# Altium schematic sheet MIXR Processing - SD Card.SchDoc: Micro SD Card & Mux
size B; DocumentNumber: 15; SheetNumber: 15; SheetTotal: 15
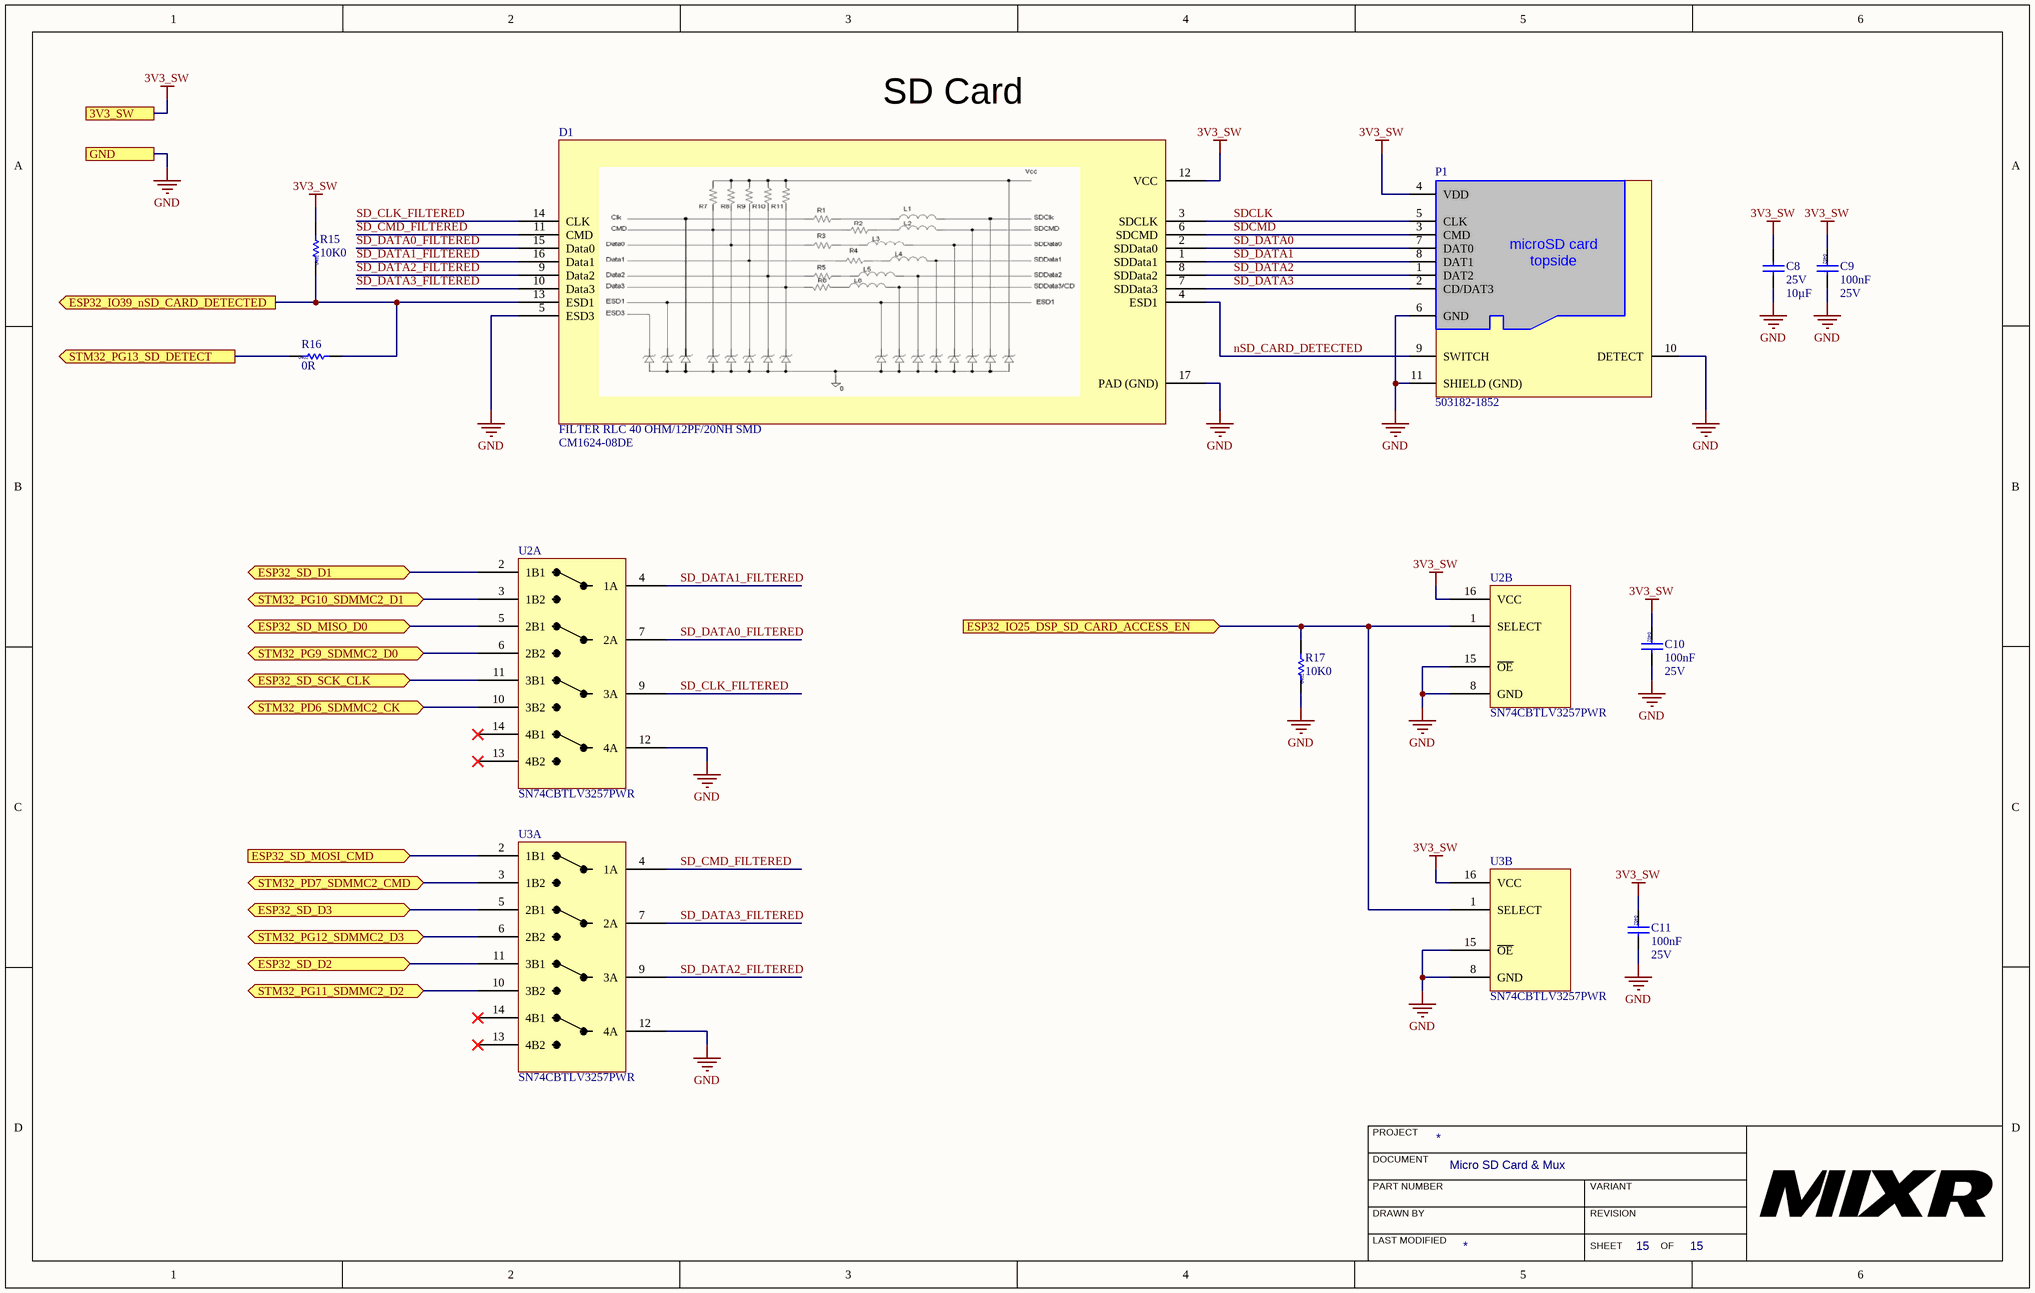
[diagram p0: MIXR Processing - SD Card.SchDoc]

## Parts
C8  Voltage - Rated: 25V  Capacitance: 10µF  [CAP, 0805]  (hidden comment: CAP CER 10uF 25V 10% X5R 0805)
C9  Capacitance: 100nF  Voltage: 25V  [CAP 0402]  (hidden comment: CAP CER 0.1UF 16V X7R 0402)
C10  Capacitance: 100nF  Voltage: 25V  [CAP 0402]  (hidden comment: CAP CER 0.1UF 16V X7R 0402)
C11  Capacitance: 100nF  Voltage: 25V  [CAP 0402]  (hidden comment: CAP CER 0.1UF 16V X7R 0402)
D1  FILTER RLC 40 OHM/12PF/20NH SMD  Manufacturer Part Number 1: CM1624-08DE  [QFN0P135X330X55_HS-17M]
P1  Manufacturer Part Number: 503182-1852  [CONN MICRO-SD HOLDER MOLEX 503182-1852]  (hidden comment: CONN MICRO-SD ULTRA-LOW 8CKT)
R15  Resistance: 10K0  [RES 0402]  (hidden comment: RES 10K OHM 1% 1/16W 0402)
R16  Resistance: 0R  [RES 0402]  (hidden comment: RES 0.0 OHM 1% 1/16W 0402)
R17  Resistance: 10K0  [RES 0402]  (hidden comment: RES 10K OHM 1% 1/16W 0402)
U2  Manufacturer Part Number: SN74CBTLV3257PWR  [TSOP65P640X120-16N]  (hidden comment: IC MUX/DEMUX 4-BIT 1-OF-2 16-TSSOP)  (parts A,B of 2)
U3  Manufacturer Part Number: SN74CBTLV3257PWR  [TSOP65P640X120-16N]  (hidden comment: IC MUX/DEMUX 4-BIT 1-OF-2 16-TSSOP)  (parts A,B of 2)

## Ports
3V3_SW, ESP32_IO25_DSP_SD_CARD_ACCESS_EN (in), ESP32_IO39_nSD_CARD_DETECTED (out), ESP32_SD_D1 (bidir), ESP32_SD_D2 (bidir), ESP32_SD_D3 (bidir), ESP32_SD_MISO_D0 (bidir), ESP32_SD_MOSI_CMD (in), ESP32_SD_SCK_CLK (bidir), GND, STM32_PD6_SDMMC2_CK (bidir), STM32_PD7_SDMMC2_CMD (bidir), STM32_PG9_SDMMC2_D0 (bidir), STM32_PG10_SDMMC2_D1 (bidir), STM32_PG11_SDMMC2_D2 (bidir), STM32_PG12_SDMMC2_D3 (bidir), STM32_PG13_SD_DETECT (out)

## Nets
3V3_SW: C8.1 C9.1 C10.1 C11.1 D1.12(VCC) P1.4(VDD) R15.2 U2.16(VCC) U3.16(VCC) ; port 3V3_SW
GND: C8.2 C9.2 C10.2 C11.2 D1.5(ESD3) D1.17(PAD_(GND)) P1.6(GND) P1.10(DETECT) P1.11(SHIELD_(GND)) R17.1 U2.8(GND) U2.12(4A) U2.15(~{OE}) U3.8(GND) U3.12(4A) U3.15(~{OE}) ; port GND
ESP32_IO25_DSP_SD_CARD_ACCESS_EN: R17.2 U2.1(SELECT) U3.1(SELECT) ; port ESP32_IO25_DSP_SD_CARD_ACCESS_EN
ESP32_IO39_nSD_CARD_DETECTED: D1.13(ESD1) R15.1 R16.2 ; port ESP32_IO39_nSD_CARD_DETECTED
ESP32_SD_D1: U2.2(1B1) ; port ESP32_SD_D1
ESP32_SD_D2: U3.11(3B1) ; port ESP32_SD_D2
ESP32_SD_D3: U3.5(2B1) ; port ESP32_SD_D3
ESP32_SD_MISO_D0: U2.5(2B1) ; port ESP32_SD_MISO_D0
ESP32_SD_MOSI_CMD: U3.2(1B1) ; port ESP32_SD_MOSI_CMD
ESP32_SD_SCK_CLK: U2.11(3B1) ; port ESP32_SD_SCK_CLK
nSD_CARD_DETECTED: D1.4(ESD1) P1.9(SWITCH)
SD_CLK_FILTERED: D1.14(CLK) U2.9(3A)
SD_CMD_FILTERED: D1.11(CMD) U3.4(1A)
SD_DATA0: D1.2(SDData0) P1.7(DAT0)
SD_DATA0_FILTERED: D1.15(Data0) U2.7(2A)
SD_DATA1: D1.1(SDData1) P1.8(DAT1)
SD_DATA1_FILTERED: D1.16(Data1) U2.4(1A)
SD_DATA2: D1.8(SDData2) P1.1(DAT2)
SD_DATA2_FILTERED: D1.9(Data2) U3.9(3A)
SD_DATA3: D1.7(SDData3) P1.2(CD/DAT3)
SD_DATA3_FILTERED: D1.10(Data3) U3.7(2A)
SDCLK: D1.3(SDCLK) P1.5(CLK)
SDCMD: D1.6(SDCMD) P1.3(CMD)
STM32_PD6_SDMMC2_CK: U2.10(3B2) ; port STM32_PD6_SDMMC2_CK
STM32_PD7_SDMMC2_CMD: U3.3(1B2) ; port STM32_PD7_SDMMC2_CMD
STM32_PG9_SDMMC2_D0: U2.6(2B2) ; port STM32_PG9_SDMMC2_D0
STM32_PG10_SDMMC2_D1: U2.3(1B2) ; port STM32_PG10_SDMMC2_D1
STM32_PG11_SDMMC2_D2: U3.10(3B2) ; port STM32_PG11_SDMMC2_D2
STM32_PG12_SDMMC2_D3: U3.6(2B2) ; port STM32_PG12_SDMMC2_D3
STM32_PG13_SD_DETECT: R16.1 ; port STM32_PG13_SD_DETECT

Not connected (* = marked no-connect by the designer): U2 13(4B2)* 14(4B1)*; U3 13(4B2)* 14(4B1)*

## Notes on the sheet
- SD Card
- PROJECT
- DOCUMENT
- DRAWN BY
- LAST MODIFIED
- PART NUMBER
- REVISION
- SHEET
- VARIANT
- OF
- (in symbol CONN MICRO-SD ULTRA-LOW 8CKT) microSD card / topside

## Library data of the parts
C8 = CAP CER 10uF 25V 10% X5R 0805: 10µF ±10% 25V Ceramic Capacitor X5R 0805 (2012 Metric); Manufacturer: Murata Electronics North America; Manufacturer Part Number: GRM21BR61E106KA73L; Supplier 1: Digi-Key; RoHS: RoHS Compliant; Category: Capacitors; Stock 1: 1695157; Packaging: Cut Tape (CT); Part Status: Active; Tolerance: ±10%; Temperature Coefficient: X5R; Operating Temperature: -55°C ~ 85°C; Features: -; Ratings: -; Applications: General Purpose; Mounting Type: Surface Mount, MLCC; Package / Case: 0805 (2012 Metric); Size / Dimension: 0.079" L x 0.049" W (2.00mm x 1.25mm); Height - Seated (Max): -; Thickness (Max): 0.053" (1.35mm); Lead Spacing: -; Lead Style: -; ComponentLink1URL: http://search.murata.co.jp/Ceramy/image/img/A01X/G101/ENG/GRM21BR61E106KA73-01.pdf; ComponentLink1Description: http://search.murata.co.jp/Ceramy/image/img/A01X/G101/ENG/GRM21BR61E106KA73-01.pdf; Supplier Part Number 1: 490-5523-1-ND; Pricing 1: 1=0.3, 10=0.214, 100=0.1008, 500=0.07068, 1000=0.05851 (CAD)
C9-C11 = CAP CER 0.1UF 16V X7R 0402: Cap Ceramic 0.1uF 25V X7R 10% SMD 0402 125C Paper T/R; Manufacturer: Murata; Manufacturer Part Number: GRM155R71E104KE14D; Supplier 1: Digi-Key; Supplier Part Number 1: 490-10698-1-ND; Packaging: Tape and Reel; ComponentLink1URL: http://www.farnell.com/datasheets/2048008.pdf?src-supplier=Farnell; ComponentLink1Description: http://www.farnell.com/datasheets/2048008.pdf?src-supplier=Farnell; Tolerance: 10%; RoHS: Yes; Category: Ceramic Capacitors; Stock 1: 785540; Pricing 1: 1=0.10000, 10=0.03400, 100=0.01520, 500=0.01088, 1000=0.00855, 2500=0.00778, 5000=0.00715 (USD); Mount: Surface Mount; Case/Package: 0402; Weight: 0.000212oz; Case Code (Metric): 1005; Case Code (Imperial): 0402; Dielectric Material: Ceramic; Min Operating Temperature: -55°C; Max Operating Temperature: 125°C; Termination: SMD/SMT; Composition: Ceramic; Package Quantity: 10000; Length: 1mm; Height: 0.5mm; Width: 0.02inch; Thickness: 0.022inch; Depth: 0.5mm; REACH SVHC: Unknown; Lead Free: Lead Free; ComponentLink2URL: http://uk.rs-online.com/webdocs/144c/0900766b8144c113.pdf?src-supplier=RSComponents; ComponentLink2Description: http://uk.rs-online.com/webdocs/144c/0900766b8144c113.pdf?src-supplier=RSComponents; ComponentLink3URL: http://www.farnell.com/datasheets/1872206.pdf?src-supplier=Farnell; ComponentLink3Description: http://www.farnell.com/datasheets/1872206.pdf?src-supplier=Farnell; ComponentLink4URL: http://components.arrow.com/part/dataview/0323_06361249?src-supplier=Arrow+Europe; ComponentLink4Description: http://components.arrow.com/part/dataview/0323_06361249?src-supplier=Arrow+Europe; ComponentLink5URL: http://www.mouser.com/ds/2/281/c02e-2905.pdf?src-supplier=Mouser; ComponentLink5Description: http://www.mouser.com/ds/2/281/c02e-2905.pdf?src-supplier=Mouser; ComponentLink6URL: http://www.farnell.com/datasheets/2048008.pdf?src-supplier=Newark; ComponentLink6Description: http://www.farnell.com/datasheets/2048008.pdf?src-supplier=Newark; ComponentLink7URL: http://psearch.en.murata.com/capacitor/product/GRM155R71E104KE14%23.pdf?src-supplier=Avnet; ComponentLink7Description: http://psearch.en.murata.com/capacitor/product/GRM155R71E104KE14%23.pdf?src-supplier=Avnet; ComponentLink8URL: https://search.murata.co.jp/Ceramy/image/img/A01X/G101/ENG/GRM155R71E104KE14-01.pdf?src-supplier=Digi-Key; ComponentLink8Description: https://search.murata.co.jp/Ceramy/image/img/A01X/G101/ENG/GRM155R71E104KE14-01.pdf?src-supplier=Digi-Key; ComponentLink9URL: http://www.farnell.com/datasheets/2048008.pdf?src-supplier=Element14; ComponentLink9Description: http://www.farnell.com/datasheets/2048008.pdf?src-supplier=Element14; Dielectric: X7R; Voltage Rating (DC): 25V; Voltage Rating: 25V
D1 = FILTER RLC 40 OHM/12PF/20NH SMD: RLC EMI Filter 3rd Order Low Pass 6 Channel R = 40Ohms, C = 12pF, L = 20nH 16-UFDFN Exposed Pad; Manufacturer 1: ON Semiconductor; Operating Supply Voltage: 5V; Capacitance: 20pF; Number of Channels: 6; DC Resistance (DCR): 40R; ESD Protection: Yes; Clamping Voltage: 9V; Direction: Bidirectional; Number of Lines: 8; Supplier 1: Digi-Key; Stock 1: 5050; Pricing 1: 1=0.52000, 10=0.48300, 25=0.46040, 50=0.44560, 100=0.43070, 250=0.40836, 500=0.34156, 1000=0.26507 (USD); RoHS: Yes; Case/Package: DFN; Number of Pins: 16; Contact Plating: Tin,Matte; Min Operating Temperature: -40°C; Max Operating Temperature: 85°C; Package Quantity: 1; Packaging: Tape and Reel; Termination: Flat; Length: 3.4mm; Height: 0.022inch; Width: 1.35mm; Depth: 1.45mm; REACH SVHC: No SVHC; Lead Free: Lead Free; Halogen Free: Halogen Free; ComponentLink1URL: https://datasheet.ciiva.com/1267/cm1624-d-1267908.pdf?src-supplier=Element14; ComponentLink1Description: https://datasheet.ciiva.com/1267/cm1624-d-1267908.pdf?src-supplier=Element14; ComponentLink2URL: https://datasheet.ciiva.com/4942/cm1624-d-92596-4942166.pdf?src-supplier=Mouser; ComponentLink2Description: https://datasheet.ciiva.com/4942/cm1624-d-92596-4942166.pdf?src-supplier=Mouser; ComponentLink3URL: https://datasheet.ciiva.com/26793/cm1624-08de-26793355.pdf?src-supplier=IIIC; ComponentLink3Description: https://datasheet.ciiva.com/26793/cm1624-08de-26793355.pdf?src-supplier=IIIC; ComponentLink4URL: https://datasheet.ciiva.com/1022/cm1624-d-1022810.pdf?src-supplier=Digi-Key; ComponentLink4Description: https://datasheet.ciiva.com/1022/cm1624-d-1022810.pdf?src-supplier=Digi-Key; ComponentLink5URL: https://datasheet.ciiva.com/15225/getdatasheetpartid-650344-15225530.pdf?src-supplier=Verical; ComponentLink5Description: https://datasheet.ciiva.com/15225/getdatasheetpartid-650344-15225530.pdf?src-supplier=Verical; ComponentLink6URL: https://datasheet.ciiva.com/3067/cm1624-d-3067220.pdf?src-supplier=Avnet; ComponentLink6Description: https://datasheet.ciiva.com/3067/cm1624-d-3067220.pdf?src-supplier=Avnet; ComponentLink7URL: https://datasheet.ciiva.com/3067/cm1624-d-3067221.pdf?src-supplier=Avnet; ComponentLink7Description: https://datasheet.ciiva.com/3067/cm1624-d-3067221.pdf?src-supplier=Avnet; ComponentLink8URL: https://datasheet.ciiva.com/1022/cm1624-d-1022808.pdf?src-supplier=Digi-Key; ComponentLink8Description: https://datasheet.ciiva.com/1022/cm1624-d-1022808.pdf?src-supplier=Digi-Key; ComponentLink9URL: https://datasheet.ciiva.com/1022/cm1624-d-1022809.pdf?src-supplier=Digi-Key; ComponentLink9Description: https://datasheet.ciiva.com/1022/cm1624-d-1022809.pdf?src-supplier=Digi-Key; Supplier Part Number 1: CM1624-08DEOSCT-ND
P1 = CONN MICRO-SD ULTRA-LOW 8CKT: 9 (8 + 1) Position Card Connector microSD™ Surface Mount, Right Angle Gold /; Manufacturer: Molex; Gender: Male; Number of Circuits: 8; Pitch: 1.1mm; Supplier 1: Digi-Key; RoHS: Yes; Stock 1: 36042; Pricing 1: 1 = 2.45000, 10 = 2.22400, 25 = 2.08840, 50 = 1.99740, 100 = 1.90670, 250 = 1.72508, 500 = 1.58890 (USD); Mount: Surface Mount; Contact Material: Copper Alloy; Contact Plating: Gold; Housing Material: Polymer; Min Operating Temperature: -25°C; Max Operating Temperature: 85°C; Number of Rows: 1; Package Quantity: 1600; Packaging: Tape and Reel; Connector Type: Connector; Termination: Solder; Orientation: Right Angle; Length: 15.2mm; Depth: 14.95mm; REACH SVHC: No SVHC; Halogen Free: Low Halogen; Supplier Part Number 1: WM12834CT-ND
R15 R17 = RES 10K OHM 1% 1/16W 0402: Surface Mount Thick Film Resistor, Rc Series, 10 Kohm, 62.5 Mw, - 1%, 50 V, 0402 [1005 Metric]; Manufacturer: Yageo; Manufacturer Part Number: RC0402FR-0710KL; Temperature Coefficient: 100ppm/°C; Voltage Rating: 50V; Power Rating: 62.5mW; Supplier 1: Digi-Key; Supplier Part Number 1: 311-10.0KLRCT-ND; Packaging: Tape and Reel; Composition: Thick Film; ComponentLink1URL: https://datasheet.ciiva.com/7660/38568-7660787.pdf?src-supplier=Element14; ComponentLink1Description: https://datasheet.ciiva.com/7660/38568-7660787.pdf?src-supplier=Element14; Tolerance: 1%; RoHS: Yes; Category: Chip SMD Resistors; Stock 1: 60761136; Pricing 1: 1=0.10000, 10=0.01600, 100=0.00640, 1000=0.00289, 2500=0.00251, 5000=0.00207 (USD); Case/Package: 0402; Number of Pins: 2; Case Code (Imperial): 0402; Case Code (Metric): 1005; Min Operating Temperature: -55°C; Max Operating Temperature: 155°C; Voltage Rating (DC): 50V; Termination: SMD/SMT; Military Standard: Not; Working Voltage: 50V; Number of Terminations: 2; Length: 1mm; Height: 0.32mm; Width: 0.5mm; Depth: 0.5mm; Lead Pitch: 0.2mm; REACH SVHC: No SVHC; Lead Free: Lead Free; ComponentLink2URL: https://datasheet.ciiva.com/7983/1018594-7983486.pdf?src-supplier=Element14; ComponentLink2Description: https://datasheet.ciiva.com/7983/1018594-7983486.pdf?src-supplier=Element14; ComponentLink3URL: https://datasheet.ciiva.com/7849/1784430-7849813.pdf?src-supplier=Element14; ComponentLink3Description: https://datasheet.ciiva.com/7849/1784430-7849813.pdf?src-supplier=Element14; ComponentLink4URL: https://datasheet.ciiva.com/7849/1686128-7849814.pdf?src-supplier=Element14; ComponentLink4Description: https://datasheet.ciiva.com/7849/1686128-7849814.pdf?src-supplier=Element14; ComponentLink5URL: https://datasheet.ciiva.com/7849/1784430-7849815.pdf?src-supplier=Element14; ComponentLink5Description: https://datasheet.ciiva.com/7849/1784430-7849815.pdf?src-supplier=Element14; ComponentLink6URL: https://datasheet.ciiva.com/22747/1018594-22747512.pdf?src-supplier=Element14; ComponentLink6Description: https://datasheet.ciiva.com/22747/1018594-22747512.pdf?src-supplier=Element14; ComponentLink7URL: https://datasheet.ciiva.com/12667/pyu-rc0402-51-rohs-l-6-r-12667067.pdf?src-supplier=Mouser; ComponentLink7Description: https://datasheet.ciiva.com/12667/pyu-rc0402-51-rohs-l-6-r-12667067.pdf?src-supplier=Mouser
R16 = RES 0.0 OHM 1% 1/16W 0402: RES SMD 0 OHM JUMPER 1/16W 0402; Manufacturer: Yageo; Manufacturer Part Number: RC0402JR-070RL; Power Rating: 62.5mW; Voltage Rating: 50V; Max Power Dissipation: 63mW; Temperature Coefficient: 200ppm/°C; Tolerance: 5%; Supplier 1: Digi-Key; Supplier Part Number 1: 311-0.0JRCT-ND; Packaging: Tape and Reel; Composition: Thick Film; ComponentLink1URL: https://datasheet.ciiva.com/2452/pyu-rc0402-51-rohs-l-6-2452608.pdf?src-supplier=Digi-Key; ComponentLink1Description: https://datasheet.ciiva.com/2452/pyu-rc0402-51-rohs-l-6-2452608.pdf?src-supplier=Digi-Key; RoHS: Yes; Category: Chip SMD Resistors; Stock 1: 49427466; Pricing 1: 1=0.10000, 10=0.01300, 25=0.00920, 50=0.00720, 100=0.00530, 250=0.00400, 500=0.00320, 1000=0.00236, 5000=0.00169 (USD); Case/Package: 0402; Contact Plating: Tin,Matte; Case Code (Metric): 1005; Case Code (Imperial): 0402; Min Operating Temperature: -55°C; Max Operating Temperature: 155°C; Package Quantity: 1; Number of Terminations: 2; Termination: SMD/SMT; Military Standard: Not; Features: Moisture Resistant; Length: 1mm; Height: 0.016inch; Width: 0.02inch; Depth: 0.5mm; Radiation Hardening: No; REACH SVHC: Unknown; Lead Free: Lead Free; ComponentLink2URL: https://datasheet.ciiva.com/11808/0900766b80c66297-11808195.pdf?src-supplier=RSComponents; ComponentLink2Description: https://datasheet.ciiva.com/11808/0900766b80c66297-11808195.pdf?src-supplier=RSComponents; ComponentLink3URL: https://datasheet.ciiva.com/2452/pyu-r-int-thick-7-2452609.pdf?src-supplier=Digi-Key; ComponentLink3Description: https://datasheet.ciiva.com/2452/pyu-r-int-thick-7-2452609.pdf?src-supplier=Digi-Key; ComponentLink4URL: https://datasheet.ciiva.com/2452/pyu-r-int-thick-7-2452610.pdf?src-supplier=Digi-Key; ComponentLink4Description: https://datasheet.ciiva.com/2452/pyu-r-int-thick-7-2452610.pdf?src-supplier=Digi-Key; ComponentLink5URL: https://datasheet.ciiva.com/8896/pyu-rc0402-51-rohs-l-6-8896201.pdf?src-supplier=Avnet; ComponentLink5Description: https://datasheet.ciiva.com/8896/pyu-rc0402-51-rohs-l-6-8896201.pdf?src-supplier=Avnet; ComponentLink6URL: https://datasheet.ciiva.com/28386/pyu-rc0402-51-rohs-l-6-28386633.pdf?src-supplier=Avnet+Europe; ComponentLink6Description: https://datasheet.ciiva.com/28386/pyu-rc0402-51-rohs-l-6-28386633.pdf?src-supplier=Avnet+Europe; ComponentLink7URL: https://datasheet.ciiva.com/22747/1018594-22747515.pdf?src-supplier=Element14; ComponentLink7Description: https://datasheet.ciiva.com/22747/1018594-22747515.pdf?src-supplier=Element14; ComponentLink8URL: https://datasheet.ciiva.com/15189/getdatasheetpartid-326379-15189533.pdf?src-supplier=Verical; ComponentLink8Description: https://datasheet.ciiva.com/15189/getdatasheetpartid-326379-15189533.pdf?src-supplier=Verical; ComponentLink9URL: https://datasheet.ciiva.com/7983/1018594-7983535.pdf?src-supplier=Element14; ComponentLink9Description: https://datasheet.ciiva.com/7983/1018594-7983535.pdf?src-supplier=Element14
U2 U3 = IC MUX/DEMUX 4-BIT 1-OF-2 16-TSSOP: TEXAS INSTRUMENTS         SN74CBTLV3257PWR            1 TO 2 QUAD FET MUX/DEMUX, TSSOP-16; Bandwidth: 200MHz; Propagation Delay: 0.25ns; Number of Channels: 4; Min Supply Voltage: 2.3V; Max Supply Voltage: 3.6V; Logic Function: Multiplexer,Demultiplexer; Number of Elements: 1; Number of Inputs: 8; On-State Resistance: 40R; Operating Supply Current: 10uA; High Level Output Current: -128mA; Low Level Output Current: 128mA; Turn-On Delay Time: 6.1ns; Supply Type: Single; Polarity: Non-Inverting; Throw Configuration: SPDT; Supplier 1: Digi-Key; Manufacturer: Texas Instruments; RoHS: Yes; Category: Decoders, Multiplexers; Stock 1: 31974; Pricing 1: 1=0.71000, 10=0.62900, 25=0.59080, 100=0.48210, 250=0.44780, 500=0.38110, 1000=0.30488 (USD); Mount: Surface Mount; Case/Package: TSSOP; Number of Pins: 16; Weight: 0.002081oz; Contact Plating: Gold; Min Operating Temperature: -40°C; Max Operating Temperature: 85°C; Packaging: Tape and Reel; Package Quantity: 1; Number of Outputs: 4; Number of Bits: 8; Quiescent Current: 10uA; Independent Circuits: 1; Length: 5mm; Height: 1.15mm; Width: 4.4mm; Radiation Hardening: No; REACH SVHC: No SVHC; Lead Free: Lead Free; ComponentLink1URL: https://datasheet.ciiva.com/15096/getdatasheetpartid-475832-15096886.pdf?src-supplier=Verical; ComponentLink1Description: https://datasheet.ciiva.com/15096/getdatasheetpartid-475832-15096886.pdf?src-supplier=Verical; ComponentLink2URL: https://datasheet.ciiva.com/34301/914507-34301751.pdf?src-supplier=Jameco; ComponentLink2Description: https://datasheet.ciiva.com/34301/914507-34301751.pdf?src-supplier=Jameco; ComponentLink3URL: https://datasheet.ciiva.com/26866/sn74cbtlv3257pwr-26866949.pdf?src-supplier=IIIC; ComponentLink3Description: https://datasheet.ciiva.com/26866/sn74cbtlv3257pwr-26866949.pdf?src-supplier=IIIC; ComponentLink4URL: https://datasheet.ciiva.com/41457/001016561-da-01-en-ic-4b-1of-sn74cbtlv3257pwr-tssop-16-tid-41457145.pdf?src-supplier=Conrad; ComponentLink4Description: https://datasheet.ciiva.com/41457/001016561-da-01-en-ic-4b-1of-sn74cbtlv3257pwr-tssop-16-tid-41457145.pdf?src-supplier=Conrad; ComponentLink5URL: https://datasheet.ciiva.com/1888/sn74cbtlv3257-1888771.pdf?src-supplier=Digi-Key; ComponentLink5Description: https://datasheet.ciiva.com/1888/sn74cbtlv3257-1888771.pdf?src-supplier=Digi-Key; ComponentLink6URL: https://datasheet.ciiva.com/1888/sn74cbtlv3257-1888772.pdf?src-supplier=Digi-Key; ComponentLink6Description: https://datasheet.ciiva.com/1888/sn74cbtlv3257-1888772.pdf?src-supplier=Digi-Key; ComponentLink7URL: https://datasheet.ciiva.com/1509/1634002-1509116.pdf?src-supplier=Element14; ComponentLink7Description: https://datasheet.ciiva.com/1509/1634002-1509116.pdf?src-supplier=Element14; ComponentLink8URL: https://datasheet.ciiva.com/3169/sn74cbtlv3257-3169116.pdf?src-supplier=Avnet; ComponentLink8Description: https://datasheet.ciiva.com/3169/sn74cbtlv3257-3169116.pdf?src-supplier=Avnet; ComponentLink9URL: https://datasheet.ciiva.com/25917/sn74cbtlv3257-25917342.pdf?src-supplier=Avnet+Europe; ComponentLink9Description: https://datasheet.ciiva.com/25917/sn74cbtlv3257-25917342.pdf?src-supplier=Avnet+Europe; Supplier Part Number 1: 296-9138-1-ND; ComponentLink10URL: https://datasheet.ciiva.com/3169/sn74cbtlv3257-3169117.pdf?src-supplier=Avnet; ComponentLink10Description: https://datasheet.ciiva.com/3169/sn74cbtlv3257-3169117.pdf?src-supplier=Avnet; ComponentLink11URL: https://datasheet.ciiva.com/1888/sn74cbtlv3257-1888773.pdf?src-supplier=Digi-Key; ComponentLink11Description: https://datasheet.ciiva.com/1888/sn74cbtlv3257-1888773.pdf?src-supplier=Digi-Key; ComponentLink12URL: https://datasheet.ciiva.com/46395/1882419-46395595.pdf?src-supplier=Element14; ComponentLink12Description: https://datasheet.ciiva.com/46395/1882419-46395595.pdf?src-supplier=Element14